# EAGLE design HoneyPI_I2C_Extenter (EAGLE 9.6.2)
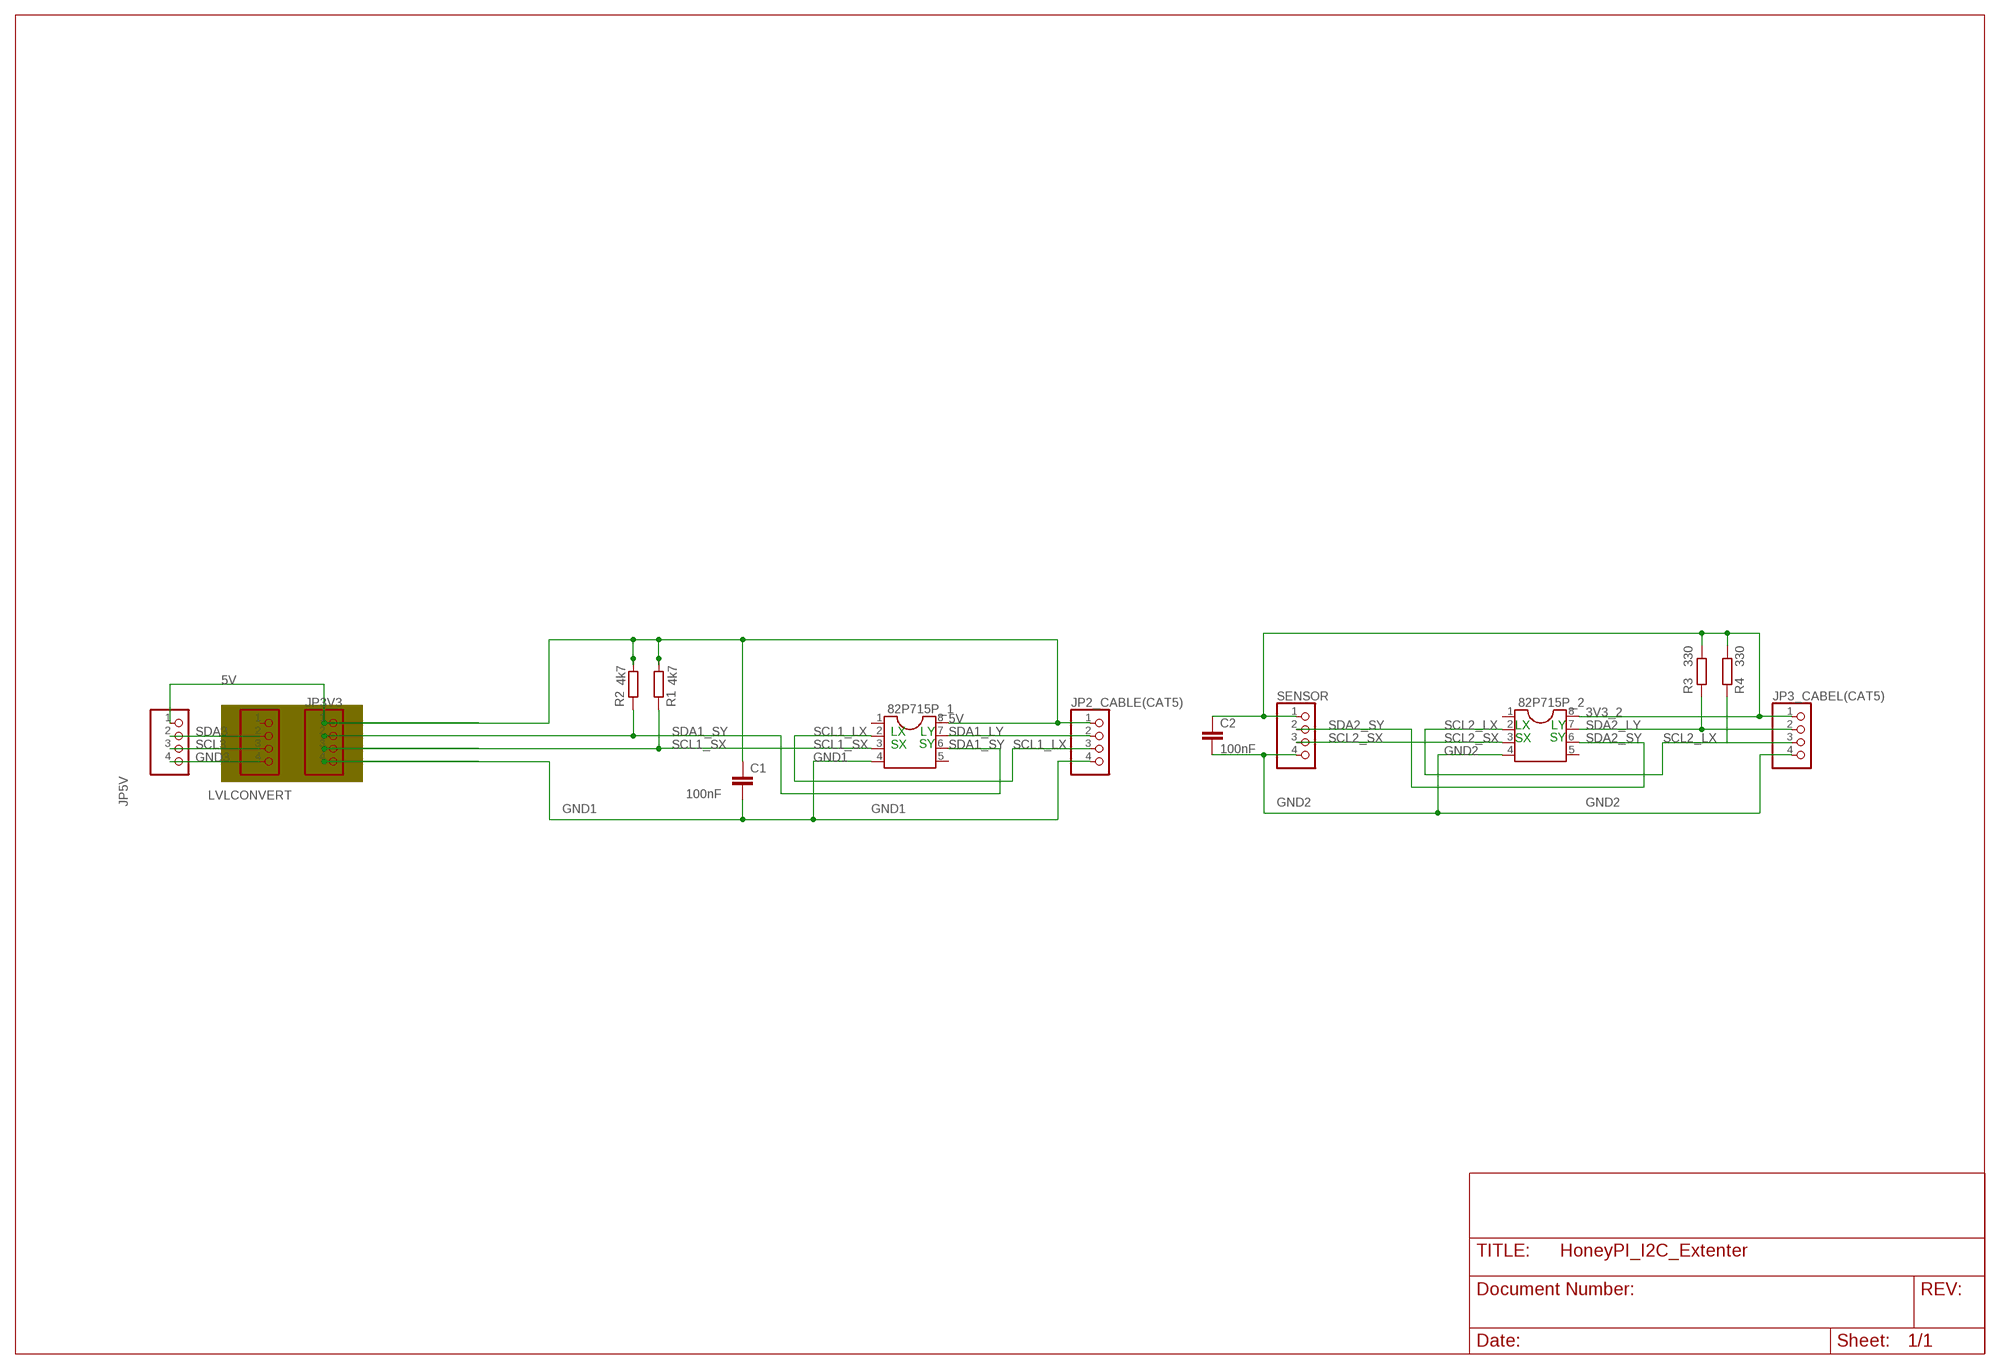
[diagram p0: schematic, sheet 1]

## Parts
82P715P_1  DIL8  [DIL08]
82P715P_2  DIL8  [DIL08]
C1  100nF  C-EU050-045X075  [C050-045X075]
C2  100nF  C-EU050-045X075  [C050-045X075]
JP2_CABLE(CAT5)  PINHD-1X4  [1X04]
JP3_CABEL(CAT5)  PINHD-1X4  [1X04]
JP3V3  PINHD-1X4  [1X04]
JP5V  PINHD-1X4  [1X04]
LVLCONVERT  PINHD-1X4  [1X04]
R1  4k7  R-EU_0207/7  [0207/7]
R2  4k7  R-EU_0207/7  [0207/7]
R3  330  R-EU_0207/7  [0207/7]
R4  330  R-EU_0207/7  [0207/7]
SENSOR  PINHD-1X4  [1X04]

## Nets
3V3_2 [3v3]: 82P715P_2.8 C2.1 JP3_CABEL(CAT5).1 R3.1 R4.1 SENSOR.1
5V [5V]: 82P715P_1.8 C1.1 JP2_CABLE(CAT5).1 JP3V3.1 JP5V.1 R1.1 R2.1
GND1: 82P715P_1.4 C1.2 JP2_CABLE(CAT5).4 JP3V3.4
GND2 [3v3]: 82P715P_2.4 C2.2 JP3_CABEL(CAT5).4 SENSOR.4
GND3: JP5V.4 LVLCONVERT.4
SCL1_LX: 82P715P_1.2 JP2_CABLE(CAT5).3
SCL1_SX: 82P715P_1.3 JP3V3.3 R1.2
SCL2_LX: 82P715P_2.2 JP3_CABEL(CAT5).3 R4.2
SCL2_SX: 82P715P_2.3 SENSOR.3
SCL3: JP5V.3 LVLCONVERT.3
SDA1_LY: 82P715P_1.7 JP2_CABLE(CAT5).2
SDA1_SY: 82P715P_1.6 JP3V3.2 R2.2
SDA2_LY: 82P715P_2.7 JP3_CABEL(CAT5).2 R3.2
SDA2_SY: 82P715P_2.6 SENSOR.2
SDA3: JP5V.2 LVLCONVERT.2
Unconnected: 82P715P_1.1 82P715P_1.5 82P715P_2.1 82P715P_2.5 LVLCONVERT.1

## Notes on the sheet
- LX | LY
- LX | LY
- SX | SY
- SX | SY

## Library data of the parts
82P715P_1 82P715P_2 = ic-package:DIL8: Dual In Line / Socket
C1 C2 = rcl:C-EU: CAPACITOR, European symbol; SPICEPREFIX: C
JP2_CABLE(CAT5) JP3_CABEL(CAT5) JP3V3 JP5V LVLCONVERT SENSOR = pinhead:PINHD-1X4: PIN HEADER
R1-R4 = rcl:R-EU_: RESISTOR, European symbol; SPICEPREFIX: R

## Net classes
0 Signal: width 0.152 mm, clearance 0.3 mm
1 3v3: width 0.254 mm, clearance 0.3 mm
2 5V: width 0.406 mm, clearance 0.3 mm

## Board
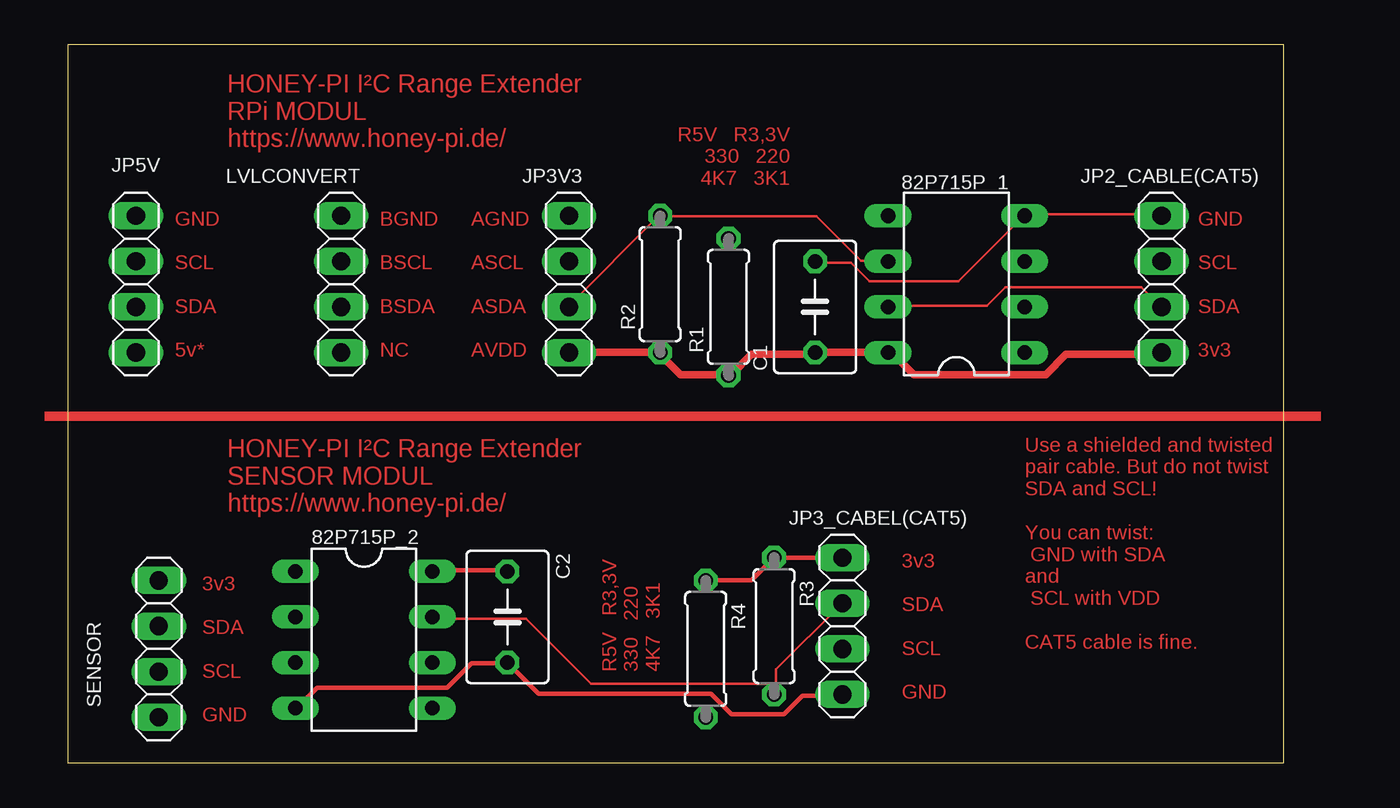
[diagram p1: board, top side]
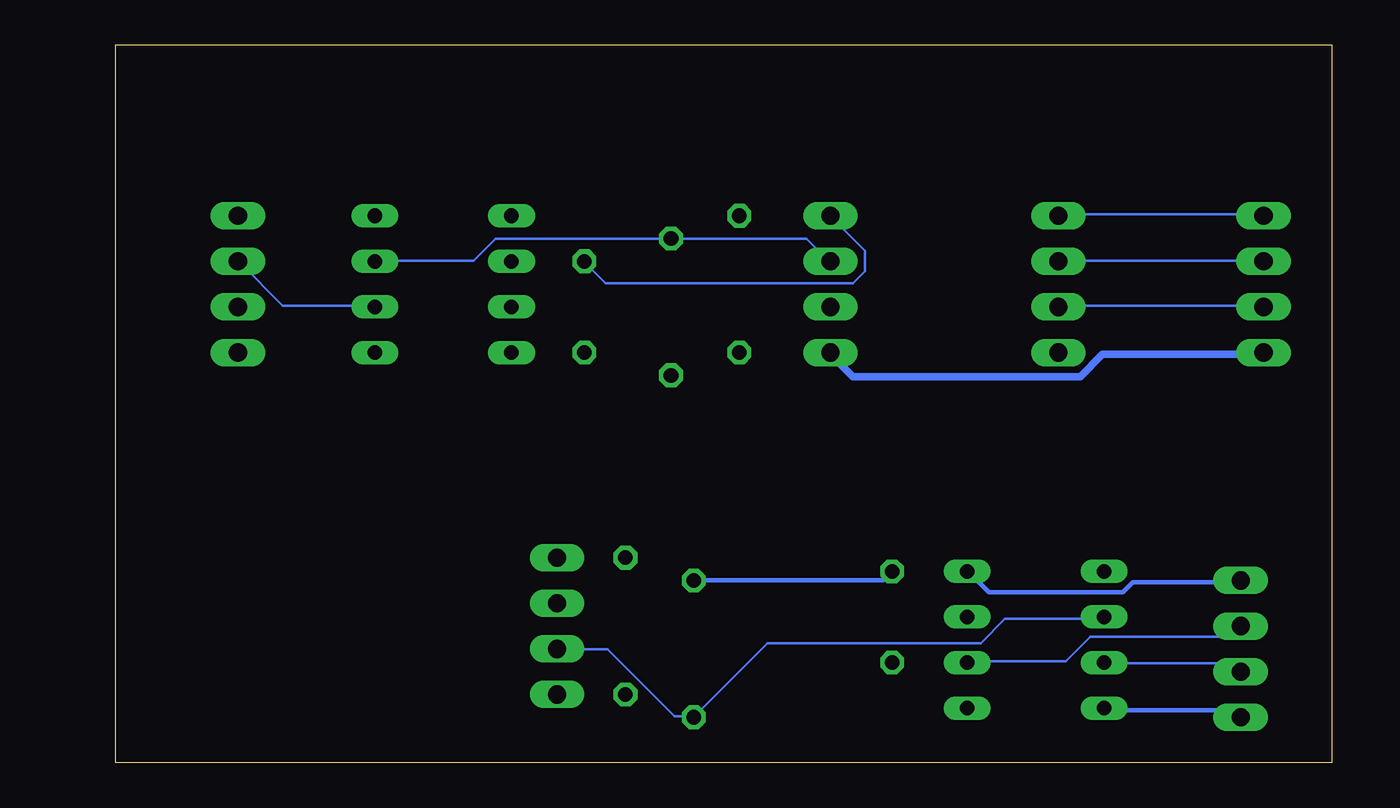
[diagram p2: board, bottom side, seen from below]

Size 67.78 x 40 mm. Coordinates in mm from the lower left corner, seen from the top.
Outline: 0,0 67.78,0 67.78,40 0,40 0,0
Copper layers (1*16): Top 0.035mm / dielectric 1.5mm / Bottom 0.035mm
Design rules "default": minimum track width 6mil, minimum drill 0.35mm, track to track 6mil, track to pad 6mil, pad to pad 6mil, via to via 6mil, smd to smd 6mil, copper to edge 40mil, drill to drill 6mil, minimum pad ring 10mil, minimum via ring 8mil, stop-mask expansion 4mil, vias tented up to drill 0mil, thermal gap 10mil

### Footprints (pad centres in the part's own frame; a part is rotated, then mirrored left to right if it is on the bottom)
DIL08 = drill 0.813 long: 1 -3.81,-3.81; 2 -1.27,-3.81; 3 1.27,-3.81; 4 3.81,-3.81; 5 3.81,3.81; 6 1.27,3.81; 7 -1.27,3.81; 8 -3.81,3.81
C050-045X075 = drill 0.813 octagon: 1 -2.54,0; 2 2.54,0
1X04 = drill 1.016 long: 1 -3.81,0; 2 -1.27,0; 3 1.27,0; 4 3.81,0
0207/7 = drill 0.813 octagon: 1 -3.81,0; 2 3.81,0

### Placement (x,y rotation side)
82P715P_1  49.53,26.67 90 top
82P715P_2  16.51,6.86 270 top
C1  41.66,25.4 90 top
C2  24.51,8.13 270 top
JP2_CABLE(CAT5)  60.96,26.67 90 top
JP3_CABEL(CAT5)  43.18,7.62 270 top
JP3V3  27.94,26.67 90 top
JP5V  3.81,26.67 90 top
LVLCONVERT  15.24,26.67 90 top
R1  36.83,25.4 90 top
R2  33.02,26.67 90 top
R3  39.37,7.62 270 top
R4  35.56,6.35 270 top
SENSOR  5.08,6.35 270 top

### Tracks (layer width: path | path; a pad name or v marks a point on that pad's centre or on a via)
3V3_2
  Top 0.254: R4.1 35.63,10.18 38.12,10.18 R3.1 39.47,11.42 43.09,11.42 JP3_CABEL(CAT5).1 | 82P715P_2.8 20.36,10.74 24.43,10.74 C2.1
  Bottom 0.254: SENSOR.1 5.09,10.07 11.08,10.07 11.65,9.5 19.11,9.5 20.25,10.63 82P715P_2.8 | R4.1 35.51,10.18 25,10.18 24.54,10.63 C2.1
5V
  Top 0.406: JP2_CABLE(CAT5).1 60.85,22.76 55.65,22.76 54.51,21.63 47.16,21.63 45.92,22.87 82P715P_1.8 45.69,22.87 41.73,22.87 C1.1 41.51,22.76 38.12,22.76 36.98,21.63 R1.1 36.76,21.63 34.16,21.63 33.02,22.76 R2.1 32.91,22.87 28.05,22.87 JP3V3.1
  Bottom 0.406: JP5V.1 3.85,22.76 12.78,22.76 14.02,21.52 26.69,21.52 27.94,22.76 JP3V3.1
GND1
  Top 0.152: C1.2 41.73,27.85 43.66,27.85 44.67,26.83 49.65,26.83 53.27,30.45 82P715P_1.4 53.38,30.56 60.85,30.56 JP2_CABLE(CAT5).4
  Bottom 0.152: JP3V3.4 27.94,30.45 26.01,28.53 26.01,27.4 26.69,26.72 40.49,26.72 41.62,27.85 C1.2
GND2
  Top 0.254: 82P715P_2.4 12.78,3.05 13.91,4.18 21.15,4.18 22.51,5.54 24.43,5.54 C2.2 24.54,5.54 26.24,3.85 35.85,3.85 36.98,2.71 39.92,2.71 40.94,3.73 43.09,3.73 JP3_CABEL(CAT5).4
  Bottom 0.254: 82P715P_2.4 12.67,2.94 5.43,2.94 5.09,2.6 SENSOR.4
GND3
  Bottom 0.152: JP5V.4 3.85,30.56 15.15,30.56 LVLCONVERT.4
SCL1_LX
  Bottom 0.152: 82P715P_1.2 53.38,25.47 58.47,25.47 60.85,27.85 JP2_CABLE(CAT5).3
SCL1_SX
  Bottom 0.152: JP3V3.3 28.05,27.96 29.29,29.21 36.76,29.21 R1.2 36.87,29.21 46.6,29.21 47.84,27.96 53.27,27.96 82P715P_1.3
SCL2_LX
  Bottom 0.152: JP3_CABEL(CAT5).3 43.09,6.33 40.38,6.33 36.64,2.6 35.63,2.6 R4.2 35.51,2.6 31.44,6.67 19.57,6.67 18.21,8.03 12.78,8.03 82P715P_2.2
SCL2_SX
  Bottom 0.152: SENSOR.3 5.54,5.54 12.67,5.54 82P715P_2.3
SCL3
  Bottom 0.152: JP5V.3 3.85,27.96 15.15,27.96 LVLCONVERT.3
SDA1_LY
  Top 0.152: 82P715P_1.7 45.81,25.47 51.23,25.47 52.25,26.49 59.83,26.49 60.85,25.47 JP2_CABLE(CAT5).2
SDA1_SY
  Top 0.152: JP3V3.2 27.94,25.47 32.91,30.45 R2.2 33.02,30.45 41.73,30.45 44.22,27.96 45.69,27.96 82P715P_1.6
SDA2_LY
  Top 0.152: 39.47,4.41 39.47,5.2 43.09,8.82 JP3_CABEL(CAT5).2 | 39.47,4.41 39.47,3.85 R3.2 39.47,4.41 | 39.47,4.41 29.18,4.41 25.56,8.03 20.36,8.03 82P715P_2.7
SDA2_SY
  Bottom 0.152: 82P715P_2.6 20.25,5.66 14.82,5.66 13.46,7.01 5.66,7.01 5.09,7.58 SENSOR.2
SDA3
  Bottom 0.152: JP5V.2 3.85,25.47 15.15,25.47 LVLCONVERT.2
(copper drawn outside any net)
  shapes: Top area x1

### Text on the board
Top: R5V R3,3V / 330 220 / 4K7 3K1 | HONEY-PI I²C Range Extender / RPi MODUL / https://www.honey-pi.de/ | GND / / SCL / / SDA / / 5v* | BGND / / BSCL / / BSDA / / NC | AGND / / ASCL / / ASDA / / AVDD | GND / / SCL / / SDA / / 3v3 | HONEY-PI I²C Range Extender / SENSOR MODUL / https://www.honey-pi.de/ | Use a shielded and twisted / pair cable. But do not twist / SDA and SCL! / / You can twist: / GND with SDA / and / SCL with VDD / / CAT5 cable is fine. | R5V R3,3V / 330 220 / 4K7 3K1 | 3v3 / / SDA / / SCL / / GND | 3v3 / / SDA / / SCL / / GND